# Altium schematic sheet MCU.SchDoc
size A3; SheetNumber: 2; SheetTotal: 2; SPICEModelCacheORLCMOXJ: <root> / <DocumentId>ORLCMOXJ</DocumentId> / <CacheFrame Number="0"> / <Model Name="cap" Kind="MDL"> / <Text>*Default semiconductor capacitor / .MODEL CAP C()</Text> / </Model> / <Model Name="xtal" Kind="CKT"> / <Text>*Generic type:crystal pkg:HC33/51 / .SUBCKT XTAL 1 2 PARAMS: FREQ=1Meg RS=750 C=13pf Q=1000 / LX 1 3 {((Q*RS)/(6.2831852*FREQ))} IC=0.5M / CX 3 4 {(1/(Q*6.2831852*FREQ*RS))} / C0 1 2 {C} / RS 4 2 {RS} / .ENDS XTAL</Text> / </Model> / </CacheFrame> / </root>
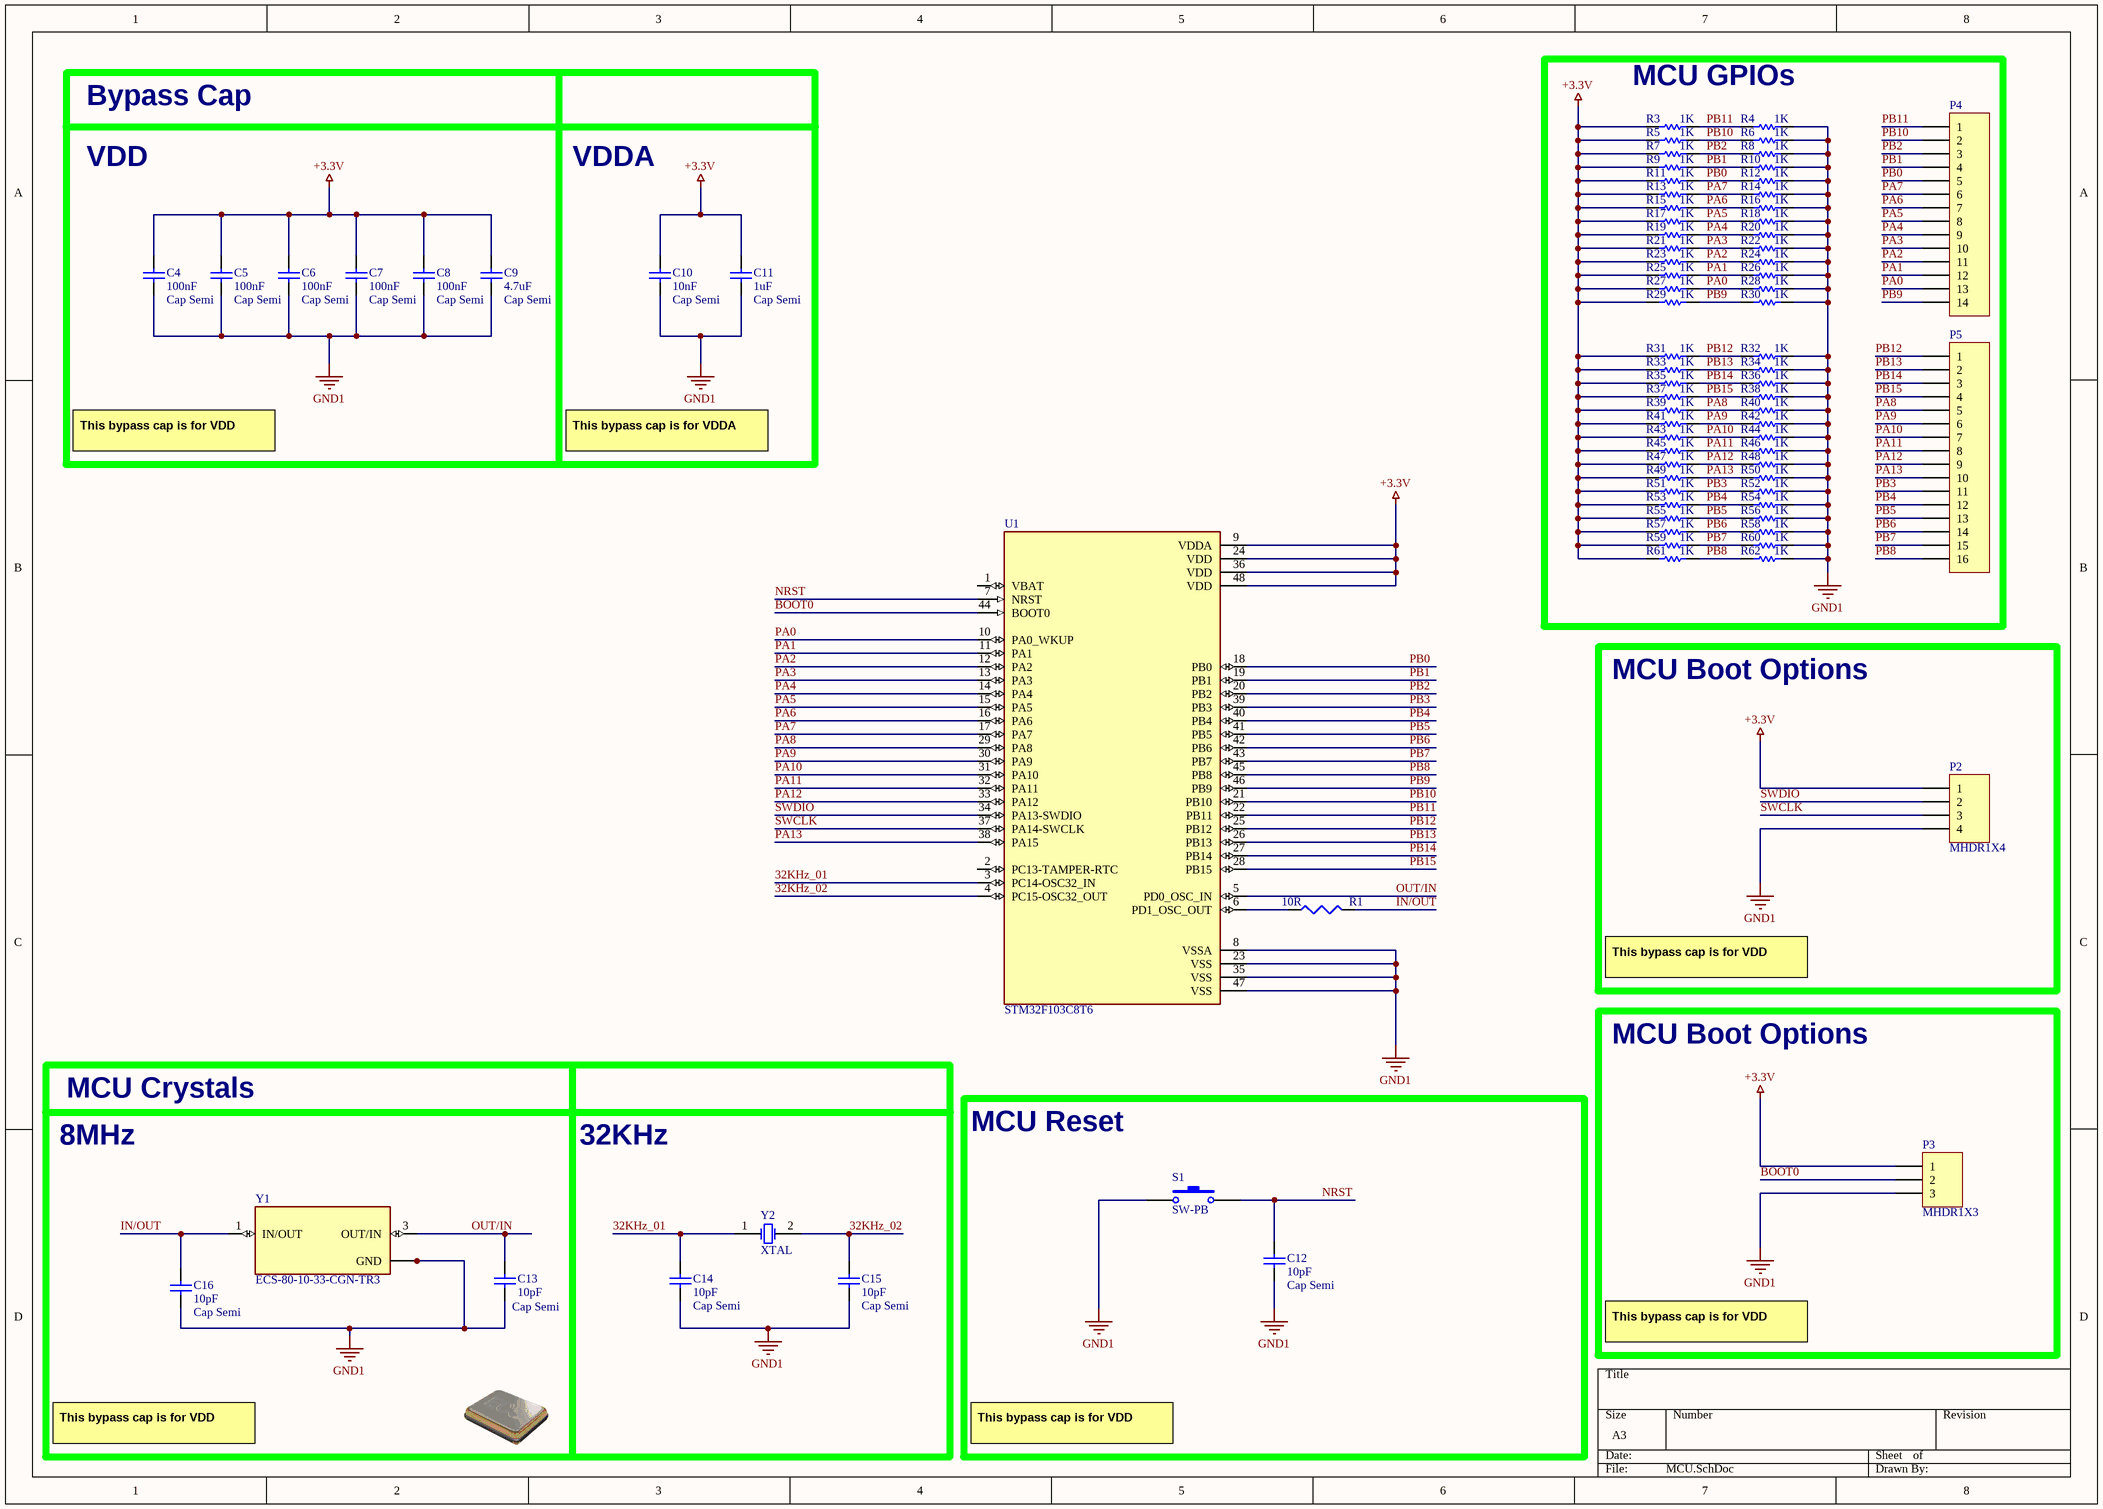
[diagram p0: MCU.SchDoc]

## Parts
C4  Cap Semi  value 100nF  [1608[0603]]
C5  Cap Semi  value 100nF  [1608[0603]]
C6  Cap Semi  value 100nF  [1608[0603]]
C7  Cap Semi  value 100nF  [1608[0603]]
C8  Cap Semi  value 100nF  [1608[0603]]
C9  Cap Semi  value 4.7uF  [1608[0603]]
C10  Cap Semi  value 10nF  [1608[0603]]
C11  Cap Semi  value 1uF  [1608[0603]]
C12  Cap Semi  value 10pF  [0402]
C13  Cap Semi  value 10pF  [0402]
C14  Cap Semi  value 10pF  [0402]
C15  Cap Semi  value 10pF  [0402]
C16  Cap Semi  value 10pF  [0402]
P2  MHDR1X4  [MHDR1X4]
P3  MHDR1X3  [MHDR1X3]
P4  Header 14  [MY_FE14]  (value not drawn)
P5  Header 16  [MY_FE16]  (value not drawn)
R1  value 10R  [J1-0603]  (hidden comment: Res3)
R3  1K  [MY_0603]
R4  1K  [MY_0603]
R5  1K  [MY_0603]
R6  1K  [MY_0603]
R7  1K  [MY_0603]
R8  1K  [MY_0603]
R9  1K  [MY_0603]
R10  1K  [MY_0603]
R11  1K  [MY_0603]
R12  1K  [MY_0603]
R13  1K  [MY_0603]
R14  1K  [MY_0603]
R15  1K  [MY_0603]
R16  1K  [MY_0603]
R17  1K  [MY_0603]
R18  1K  [MY_0603]
R19  1K  [MY_0603]
R20  1K  [MY_0603]
R21  1K  [MY_0603]
R22  1K  [MY_0603]
R23  1K  [MY_0603]
R24  1K  [MY_0603]
R25  1K  [MY_0603]
R26  1K  [MY_0603]
R27  1K  [MY_0603]
R28  1K  [MY_0603]
R29  1K  [MY_0603]
R30  1K  [MY_0603]
R31  1K  [MY_0603]
R32  1K  [MY_0603]
R33  1K  [MY_0603]
R34  1K  [MY_0603]
R35  1K  [MY_0603]
R36  1K  [MY_0603]
R37  1K  [MY_0603]
R38  1K  [MY_0603]
R39  1K  [MY_0603]
R40  1K  [MY_0603]
R41  1K  [MY_0603]
R42  1K  [MY_0603]
R43  1K  [MY_0603]
R44  1K  [MY_0603]
R45  1K  [MY_0603]
R46  1K  [MY_0603]
R47  1K  [MY_0603]
R48  1K  [MY_0603]
R49  1K  [MY_0603]
R50  1K  [MY_0603]
R51  1K  [MY_0603]
R52  1K  [MY_0603]
R53  1K  [MY_0603]
R54  1K  [MY_0603]
R55  1K  [MY_0603]
R56  1K  [MY_0603]
R57  1K  [MY_0603]
R58  1K  [MY_0603]
R59  1K  [MY_0603]
R60  1K  [MY_0603]
R61  1K  [MY_0603]
R62  1K  [MY_0603]
S1  SW-PB  [SPST-2]
U1  STM32F103C8T6  [QFP50P900X900X160-48N]
Y1  ECS-80-10-33-CGN-TR3  [XTAL_ECS-80-10-33-CGN-TR3]
Y2  XTAL  [R38]

## Blocks framed on the sheet
MCU GPIOs: P4 P5 R3-R62
MCU Boot Options: P2
MCU Boot Options: P3
MCU Reset: C12 S1

## Nets
+3.3V: C4.2 C5.2 C6.2 C7.2 C8.2 C9.2 C10.2 C11.2 P2.1 P3.1 R3.1 R5.1 R7.1 R9.1 R11.1 R13.1 R15.1 R17.1 R19.1 R21.1 R23.1 R25.1 R27.1 R29.1 R31.1 R33.1 R35.1 R37.1 R39.1 R41.1 R43.1 R45.1 R47.1 R49.1 R51.1 R53.1 R55.1 R57.1 R59.1 R61.1 U1.9(VDDA) U1.24(VDD) U1.36(VDD) U1.48(VDD)
GND1: C4.1 C5.1 C6.1 C7.1 C8.1 C9.1 C10.1 C11.1 C12.1 C13.1 C14.1 C15.1 C16.1 P2.4 P3.3 R4.2 R6.2 R8.2 R10.2 R12.2 R14.2 R16.2 R18.2 R20.2 R22.2 R24.2 R26.2 R28.2 R30.2 R32.2 R34.2 R36.2 R38.2 R40.2 R42.2 R44.2 R46.2 R48.2 R50.2 R52.2 R54.2 R56.2 R58.2 R60.2 R62.2 S1.1 U1.8(VSSA) U1.23(VSS) U1.35(VSS) U1.47(VSS) Y1.2(GND) Y1.4(GND)
32KHz_01: C14.2 U1.3(PC14-OSC32_IN) Y2.1(OSC1)
32KHz_02: C15.2 U1.4(PC15-OSC32_OUT) Y2.2(OSC2)
BOOT0: P3.2 U1.44(BOOT0)
IN/OUT: C16.2 R1.2 Y1.1(IN/OUT)
NRST: C12.2 S1.2 U1.7(NRST)
OUT/IN: C13.2 U1.5(PD0_OSC_IN) Y1.3(OUT/IN)
PA0: P4.13 R27.2 R28.1 U1.10(PA0_WKUP)
PA1: P4.12 R25.2 R26.1 U1.11(PA1)
PA2: P4.11 R23.2 R24.1 U1.12(PA2)
PA3: P4.10 R21.2 R22.1 U1.13(PA3)
PA4: P4.9 R19.2 R20.1 U1.14(PA4)
PA5: P4.8 R17.2 R18.1 U1.15(PA5)
PA6: P4.7 R15.2 R16.1 U1.16(PA6)
PA7: P4.6 R13.2 R14.1 U1.17(PA7)
PA8: P5.5 R39.2 R40.1 U1.29(PA8)
PA9: P5.6 R41.2 R42.1 U1.30(PA9)
PA10: P5.7 R43.2 R44.1 U1.31(PA10)
PA11: P5.8 R45.2 R46.1 U1.32(PA11)
PA12: P5.9 R47.2 R48.1 U1.33(PA12)
PA13: P5.10 R49.2 R50.1 U1.38(PA15)
PB0: P4.5 R11.2 R12.1 U1.18(PB0)
PB1: P4.4 R9.2 R10.1 U1.19(PB1)
PB2: P4.3 R7.2 R8.1 U1.20(PB2)
PB3: P5.11 R51.2 R52.1 U1.39(PB3)
PB4: P5.12 R53.2 R54.1 U1.40(PB4)
PB5: P5.13 R55.2 R56.1 U1.41(PB5)
PB6: P5.14 R57.2 R58.1 U1.42(PB6)
PB7: P5.15 R59.2 R60.1 U1.43(PB7)
PB8: P5.16 R61.2 R62.1 U1.45(PB8)
PB9: P4.14 R29.2 R30.1 U1.46(PB9)
PB10: P4.2 R5.2 R6.1 U1.21(PB10)
PB11: P4.1 R3.2 R4.1 U1.22(PB11)
PB12: P5.1 R31.2 R32.1 U1.25(PB12)
PB13: P5.2 R33.2 R34.1 U1.26(PB13)
PB14: P5.3 R35.2 R36.1 U1.27(PB14)
PB15: P5.4 R37.2 R38.1 U1.28(PB15)
SWCLK: P2.3 U1.37(PA14-SWCLK)
SWDIO: P2.2 U1.34(PA13-SWDIO)
NetR1_1: R1.1 U1.6(PD1_OSC_OUT)

Not connected (* = marked no-connect by the designer): U1 1(VBAT) 2(PC13-TAMPER-RTC)

## Notes on the sheet
- Bypass Cap
- VDD
- VDDA
- This bypass cap is for VDD
- This bypass cap is for VDDA
- MCU Crystals
- 8MHz
- 32KHz

## Library data of the parts
C4-C16 = Cap Semi: Capacitor (Semiconductor SIM Model); Published: 8-Jun-2000; LatestRevisionDate: 29-May-2009; LatestRevisionNote: IPC-7351 Footprint Added.; PackageReference: C1206; Publisher: Altium Limited; PackageDescription: Chip Capacitor
P2 = MHDR1X4: Header, 4-Pin; LatestRevisionDate: 17-Jul-2002; LatestRevisionNote: Re-released for DXP Platform.; Publisher: Altium Limited
P3 = MHDR1X3: Header, 3-Pin; LatestRevisionDate: 17-Jul-2002; LatestRevisionNote: Re-released for DXP Platform.; Publisher: Altium Limited
P4 = Header 14: Header, 14-Pin; ASiD Part Number: Header 14-AS
P5 = Header 16: Header, 16-Pin; ASiD Part Number: Header 16-AS
R1 = Res3: Resistor; Published: 8-Jun-2000; LatestRevisionDate: 29-May-2009; LatestRevisionNote: IPC-7351 Footprint Added.; PackageReference: J1-0603; Publisher: Altium Limited; PackageDescription: Chip Resistor
R3-R62 = Res: Standard resistor; ASiD Part Number: Res-AS; Value: 1K
S1 = SW-PB: Switch; Published: 24-Mar-1999; LatestRevisionDate: 17-Jul-2002; LatestRevisionNote: Re-released for DXP Platform.; PackageReference: SPST-2; Publisher: Altium Limited; PackageDescription: Switch; 2 Leads
U1 = STM32F103C8T6: ARM® Cortex®-M3 STM32F1 Microcontroller IC 32-Bit 72MHz 64KB (64K x 8) FLASH 48-LQFP (7x7); MF: STMicroelectronics; SnapEDA_Link: https://www.snapeda.com/parts/STM32F103C8T6/STMicroelectronics/view-part/?ref=snap; Package: LQFP-48 STMicroelectronics; Value: *; MP: STM32F103C8T6; Check_prices: https://www.snapeda.com/parts/STM32F103C8T6/STMicroelectronics/view-part/?ref=eda
Y2 = XTAL: Crystal Oscillator; Published: 8-Jun-2000; LatestRevisionDate: 17-Jul-2002; LatestRevisionNote: Re-released for DXP Platform.; PackageReference: R38; Publisher: Altium Limited; PackageDescription: Crystal, Thru-Hole; 2 Leads; Body 3.1 x 8.2 mm (Dia.xH)
Y1 = ECS-80-10-33-CGN-TR3: Package: None; Price: None; Value: *; MP: ECS-80-10-33-CGN-TR3; Availability: Unavailable